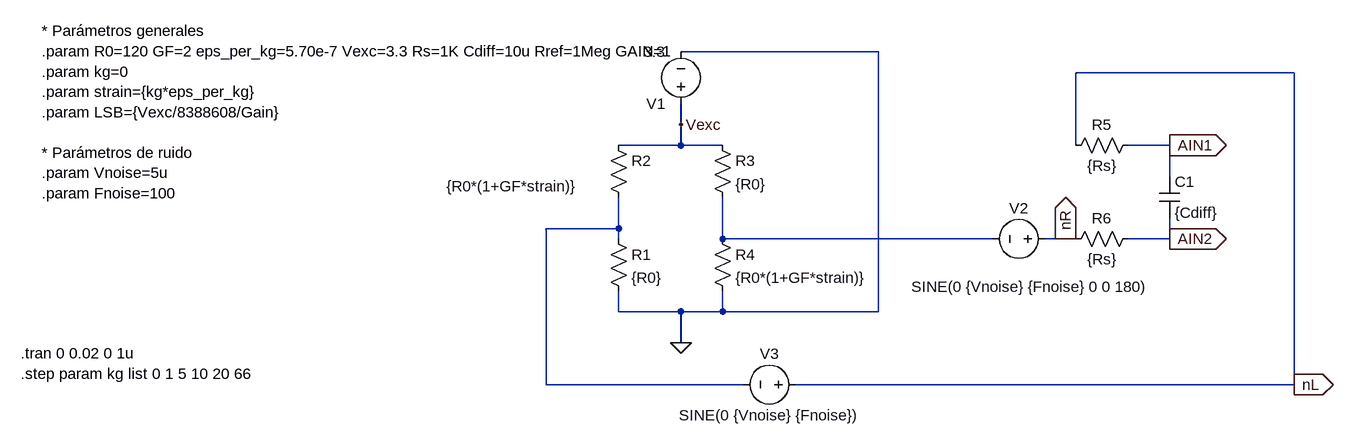
[diagram p0: schematic puente.asc]
puente.asc, the LTspice schematic file:
Version 4.1
SHEET 1 1272 680
WIRE 544 -80 240 -80
WIRE 1184 -48 848 -48
WIRE 240 32 240 0
WIRE 240 64 240 32
WIRE 240 64 144 64
WIRE 304 64 240 64
WIRE 848 64 848 -48
WIRE 992 64 928 64
WIRE 992 112 992 64
WIRE 144 192 144 144
WIRE 144 192 32 192
WIRE 144 208 144 192
WIRE 304 208 304 144
WIRE 720 208 304 208
WIRE 832 208 800 208
WIRE 848 208 832 208
WIRE 992 208 992 176
WIRE 992 208 928 208
WIRE 144 320 144 288
WIRE 240 320 144 320
WIRE 304 320 304 288
WIRE 304 320 240 320
WIRE 544 320 544 -80
WIRE 544 320 304 320
WIRE 240 368 240 320
WIRE 32 432 32 192
WIRE 336 432 32 432
WIRE 1184 432 1184 -48
WIRE 1184 432 416 432
FLAG 240 368 0
FLAG 240 32 Vexc
FLAG 1184 432 nL
IOPIN 1184 432 Out
FLAG 832 208 nR
IOPIN 832 208 Out
FLAG 992 64 AIN1
IOPIN 992 64 Out
FLAG 992 208 AIN2
IOPIN 992 208 Out
SYMBOL res 128 192 R0
SYMATTR InstName R1
SYMATTR Value {R0}
SYMBOL res 128 48 R0
WINDOW 3 -249 79 Left 2
SYMATTR Value {R0*(1+GF*strain)}
SYMATTR InstName R2
SYMBOL res 288 48 R0
SYMATTR InstName R3
SYMATTR Value {R0}
SYMBOL res 288 192 R0
SYMATTR InstName R4
SYMATTR Value {R0*(1+GF*strain)}
SYMBOL voltage 240 16 R180
WINDOW 123 0 0 Left 0
WINDOW 39 0 0 Left 0
SYMATTR InstName V1
SYMATTR Value 3.3
SYMBOL res 944 48 R90
WINDOW 0 0 56 VBottom 2
WINDOW 3 32 56 VTop 2
SYMATTR InstName R5
SYMATTR Value {Rs}
SYMBOL res 944 192 R90
WINDOW 0 0 56 VBottom 2
WINDOW 3 32 56 VTop 2
SYMATTR InstName R6
SYMATTR Value {Rs}
SYMBOL cap 976 112 R0
SYMATTR InstName C1
SYMATTR Value {Cdiff}
SYMBOL voltage 816 208 R90
WINDOW 0 -32 56 VBottom 2
WINDOW 3 58 38 VTop 2
SYMATTR InstName V2
SYMATTR Value SINE(0 {Vnoise} {Fnoise} 0 0 180)
SYMBOL voltage 432 432 R90
WINDOW 0 -32 56 VBottom 2
WINDOW 3 32 56 VTop 2
SYMATTR InstName V3
SYMATTR Value SINE(0 {Vnoise} {Fnoise})
TEXT -744 -112 Left 2 !* Parámetros generales\n.param R0=120 GF=2 eps_per_kg=5.70e-7 Vexc=3.3 Rs=1K Cdiff=10u Rref=1Meg GAIN=1\n.param kg=0\n.param strain={kg*eps_per_kg}\n.param LSB={Vexc/8388608/Gain}\n \n* Parámetros de ruido\n.param Vnoise=5u     \n.param Fnoise=100
TEXT -776 384 Left 2 !.tran 0 0.02 0 1u\n.step param kg list 0 1 5 10 20 66

The netlist it stands for:
* puente.asc
R1 N001 0 {R0}
R2 Vexc N001 {R0*(1+GF*strain)}
R3 Vexc N002 {R0}
R4 N002 0 {R0*(1+GF*strain)}
V1 Vexc 0 3.3
R5 AIN1 nL {Rs}
R6 AIN2 nR {Rs}
C1 AIN1 AIN2 {Cdiff}
V2 nR N002 SINE(0 {Vnoise} {Fnoise} 0 0 180)
V3 nL N001 SINE(0 {Vnoise} {Fnoise})
* Parámetros generales
.param R0=120 GF=2 eps_per_kg=5.70e-7 Vexc=3.3 Rs=1K Cdiff=10u Rref=1Meg GAIN=1
.param kg=0
.param strain={kg*eps_per_kg}
.param LSB={Vexc/8388608/Gain}
* Parámetros de ruido
.param Vnoise=5u
.param Fnoise=100
.tran 0 0.02 0 1u
.step param kg list 0 1 5 10 20 66
.backanno
.end